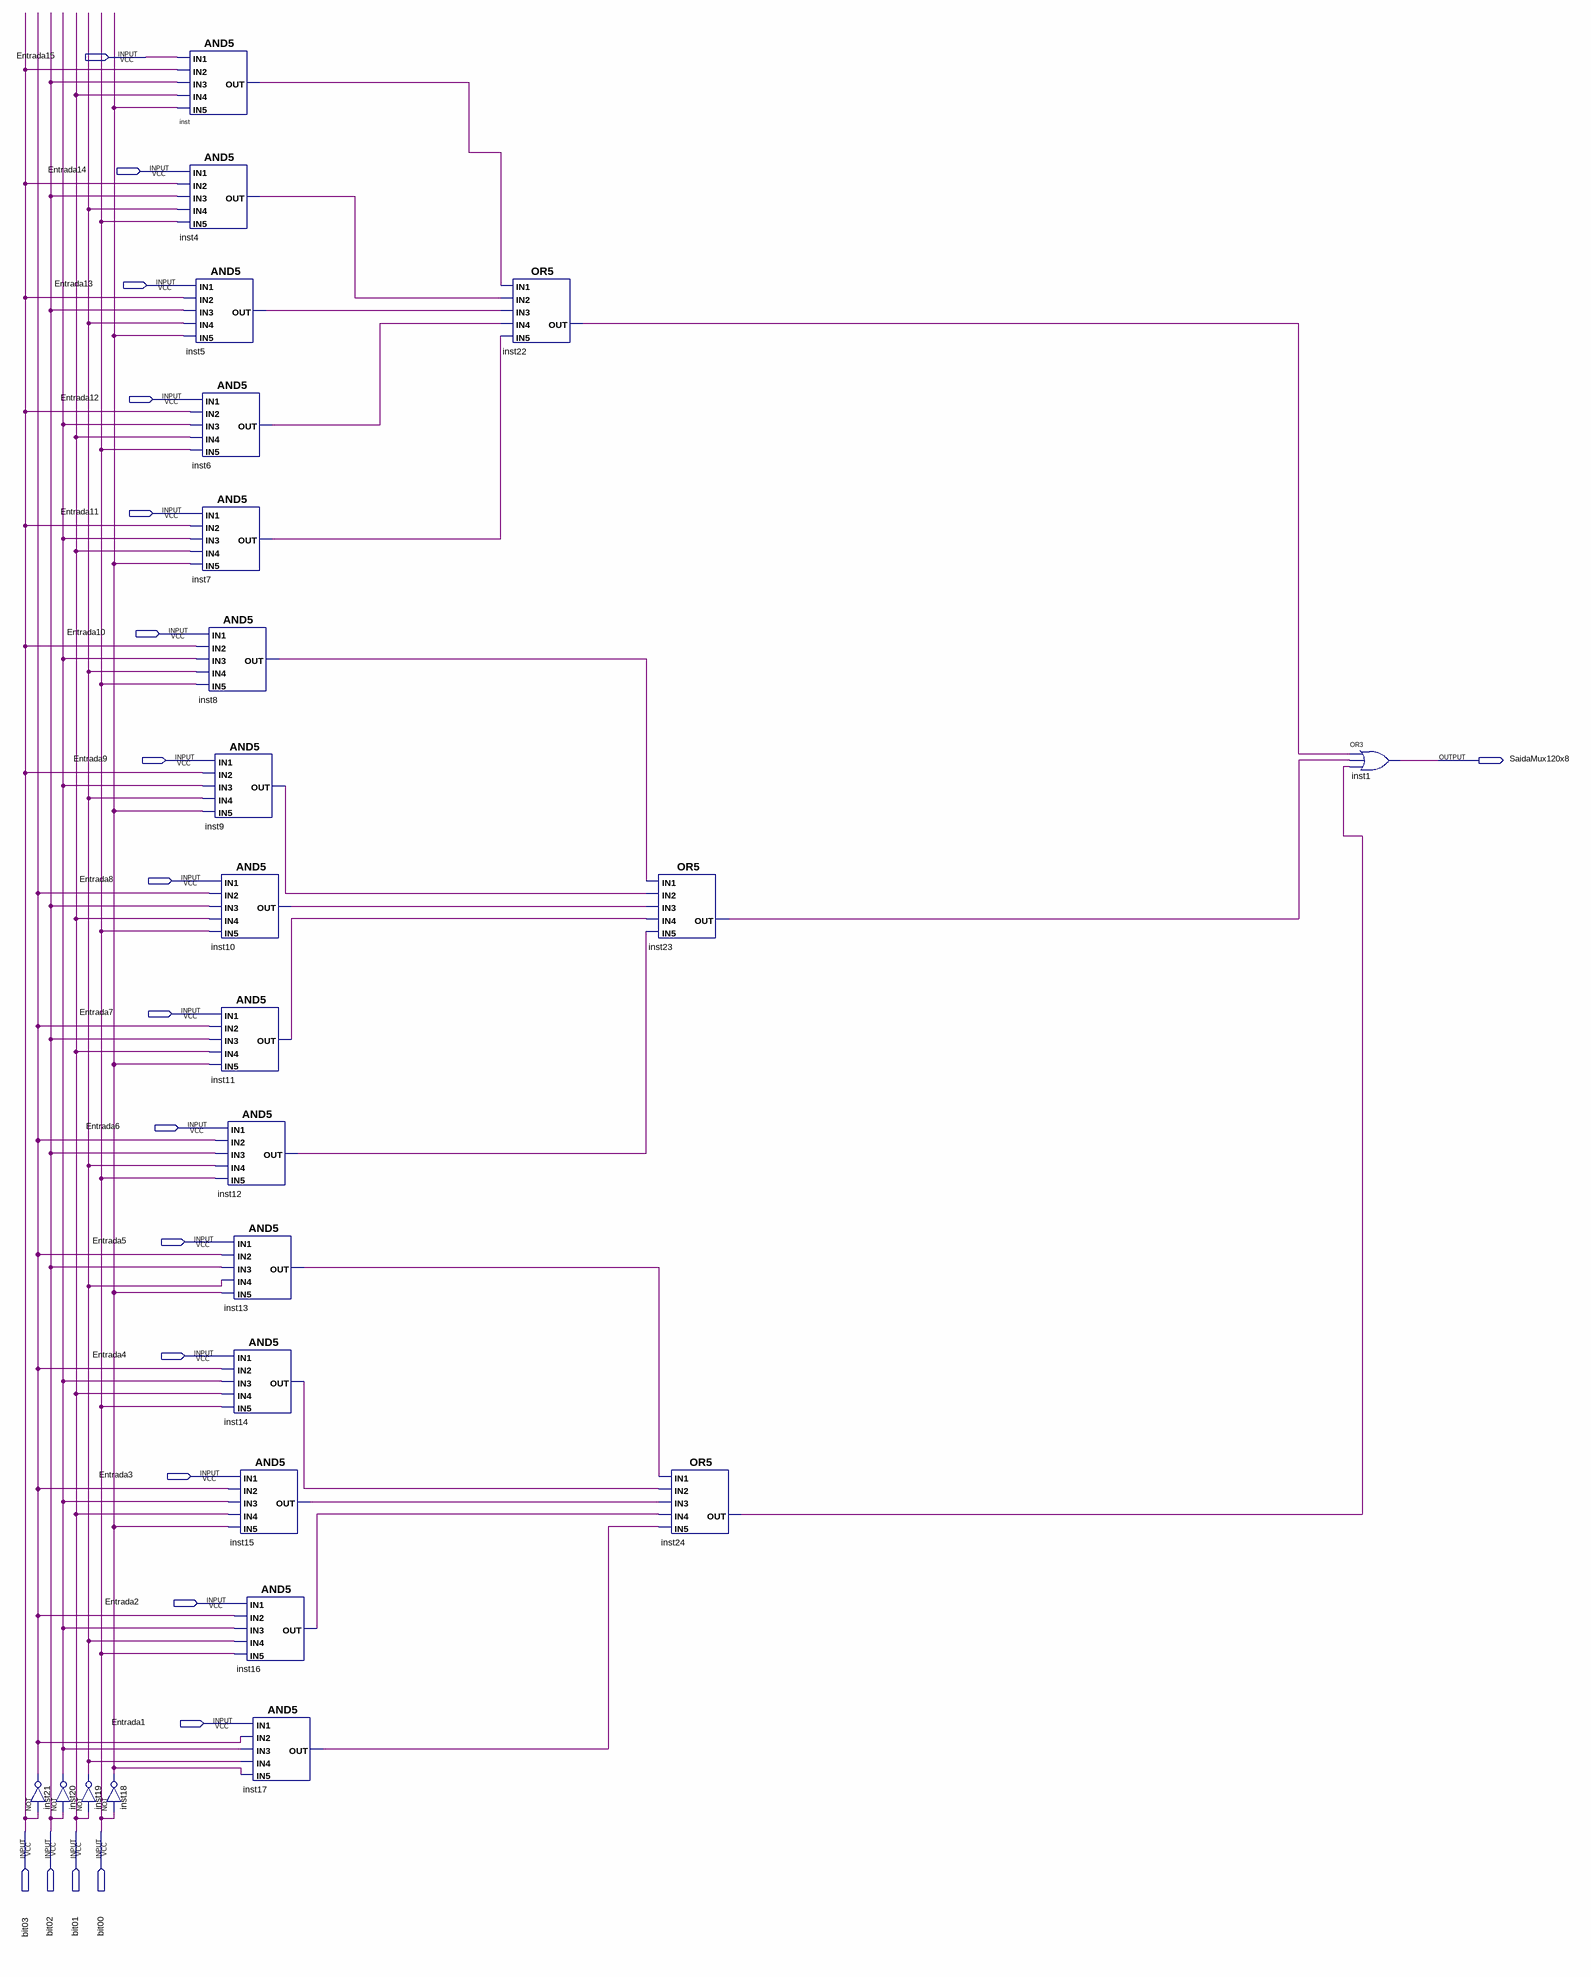
[diagram p0: schematic sheet]
// Quartus schematic Mux15x1.bdf as structural Verilog: 23 symbols, 20 pins
module Mux15x1 (
  input  Entrada15,
  input  Entrada14,
  input  Entrada13,
  input  Entrada12,
  input  Entrada11,
  input  Entrada10,
  input  Entrada9,
  input  Entrada8,
  input  Entrada7,
  input  Entrada6,
  input  Entrada5,
  input  Entrada4,
  input  Entrada3,
  input  Entrada2,
  input  Entrada1,
  input  bit03,
  input  bit02,
  input  bit01,
  input  bit00,
  output SaidaMux120x8
);

  wire inst4_out, inst5_out, inst6_out, inst7_out, inst8_out, inst9_out, inst10_out, inst11_out, inst12_out,
       inst13_out, inst14_out, inst15_out, inst16_out, inst17_out, inst18_out, inst19_out, inst20_out,
       inst21_out, inst22_out, inst23_out, inst24_out, inst_out;

  not inst21 (inst21_out, bit03);
  not inst19 (inst19_out, bit01);
  not inst20 (inst20_out, bit02);
  not inst18 (inst18_out, bit00);
  and inst (inst_out, Entrada15, bit03, bit02, bit01, inst18_out);
  and inst4 (inst4_out, Entrada14, bit03, bit02, inst19_out, bit00);
  and inst5 (inst5_out, Entrada13, bit03, bit02, inst19_out, inst18_out);
  and inst6 (inst6_out, Entrada12, bit03, inst20_out, bit01, bit00);
  and inst7 (inst7_out, Entrada11, bit03, inst20_out, bit01, inst18_out);
  and inst8 (inst8_out, Entrada10, bit03, inst20_out, inst19_out, bit00);
  and inst9 (inst9_out, Entrada9, bit03, inst20_out, inst19_out, inst18_out);
  and inst10 (inst10_out, Entrada8, inst21_out, bit02, bit01, bit00);
  and inst11 (inst11_out, Entrada7, inst21_out, bit02, bit01, inst18_out);
  and inst12 (inst12_out, Entrada6, inst21_out, bit02, inst19_out, bit00);
  and inst13 (inst13_out, Entrada5, inst21_out, bit02, inst19_out, inst18_out);
  and inst14 (inst14_out, Entrada4, inst21_out, inst20_out, bit01, bit00);
  and inst15 (inst15_out, Entrada3, inst21_out, inst20_out, bit01, inst18_out);
  and inst16 (inst16_out, Entrada2, inst21_out, inst20_out, inst19_out, bit00);
  and inst17 (inst17_out, Entrada1, inst21_out, inst20_out, inst19_out, inst18_out);
  or inst22 (inst22_out, inst_out, inst4_out, inst5_out, inst6_out, inst7_out);
  or inst23 (inst23_out, inst8_out, inst9_out, inst10_out, inst11_out, inst12_out);
  or inst24 (inst24_out, inst13_out, inst14_out, inst15_out, inst16_out, inst17_out);
  or inst1 (SaidaMux120x8, inst22_out, inst23_out, inst24_out);
endmodule
